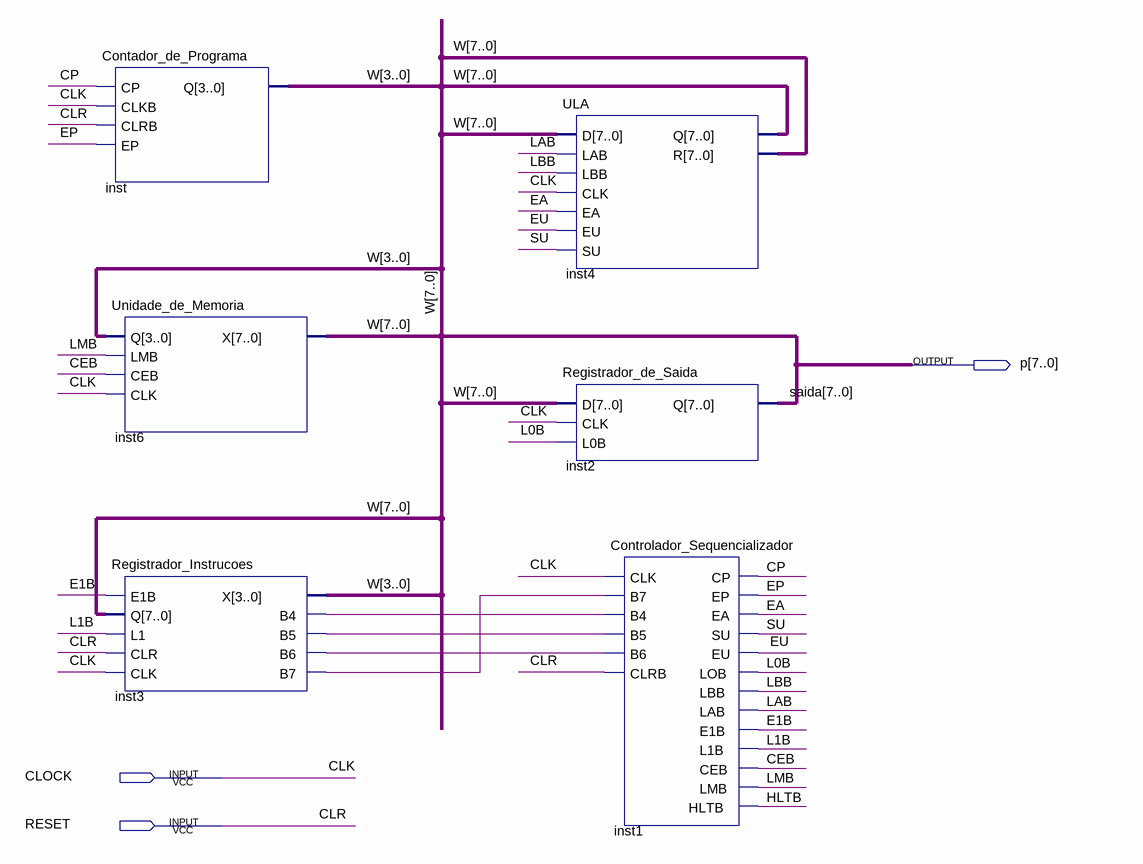
[diagram p0: schematic sheet]
// Quartus schematic Microcomputador.bdf as structural Verilog: 6 symbols, 3 pins
module Microcomputador (
  input  CLOCK,
  input  RESET,
  output [7:0] p
);

  wire CEB, CP, E1B, EA, EP, EU, HLTB, inst3_b4, inst3_b5, inst3_b6, inst3_b7, L0B, L1B, LAB, LBB, LMB, SU;

  Contador_de_Programa inst (.CP(CP), .CLKB(CLOCK), .CLRB(RESET), .EP(EP), .Q(p[3:0]));
  Unidade_de_Memoria inst6 (.Q(p[3:0]), .LMB(LMB), .CEB(CEB), .CLK(CLOCK), .X(p));
  Registrador_Instrucoes inst3 (
    .E1B(E1B), .Q(p), .L1(L1B), .CLR(RESET), .CLK(CLOCK), .X(p[3:0]), .B4(inst3_b4), .B5(inst3_b5),
    .B6(inst3_b6), .B7(inst3_b7));
  ULA inst4 (.D(p), .LAB(LAB), .LBB(LBB), .CLK(CLOCK), .EA(EA), .EU(EU), .SU(SU), .Q(p), .R(p));
  Registrador_de_Saida inst2 (.D(p), .CLK(CLOCK), .L0B(L0B), .Q(p));
  Controlador_Sequencializador inst1 (
    .CLK(CLOCK), .B7(inst3_b7), .B4(inst3_b4), .B5(inst3_b5), .B6(inst3_b6), .CLRB(RESET), .CP(CP), .EP(EP),
    .EA(EA), .SU(SU), .EU(EU), .LOB(L0B), .LBB(LBB), .LAB(LAB), .E1B(E1B), .L1B(L1B), .CEB(CEB), .LMB(LMB),
    .HLTB(HLTB));

  // Other names for the same wires on the sheet: CLK = CLOCK; CLR = RESET; saida[7:0] = p; W[7:0] = p
endmodule
